# EAGLE design Power2013 (EAGLE 5.06)
DRAWING_NAME: Xiaochuan Chen
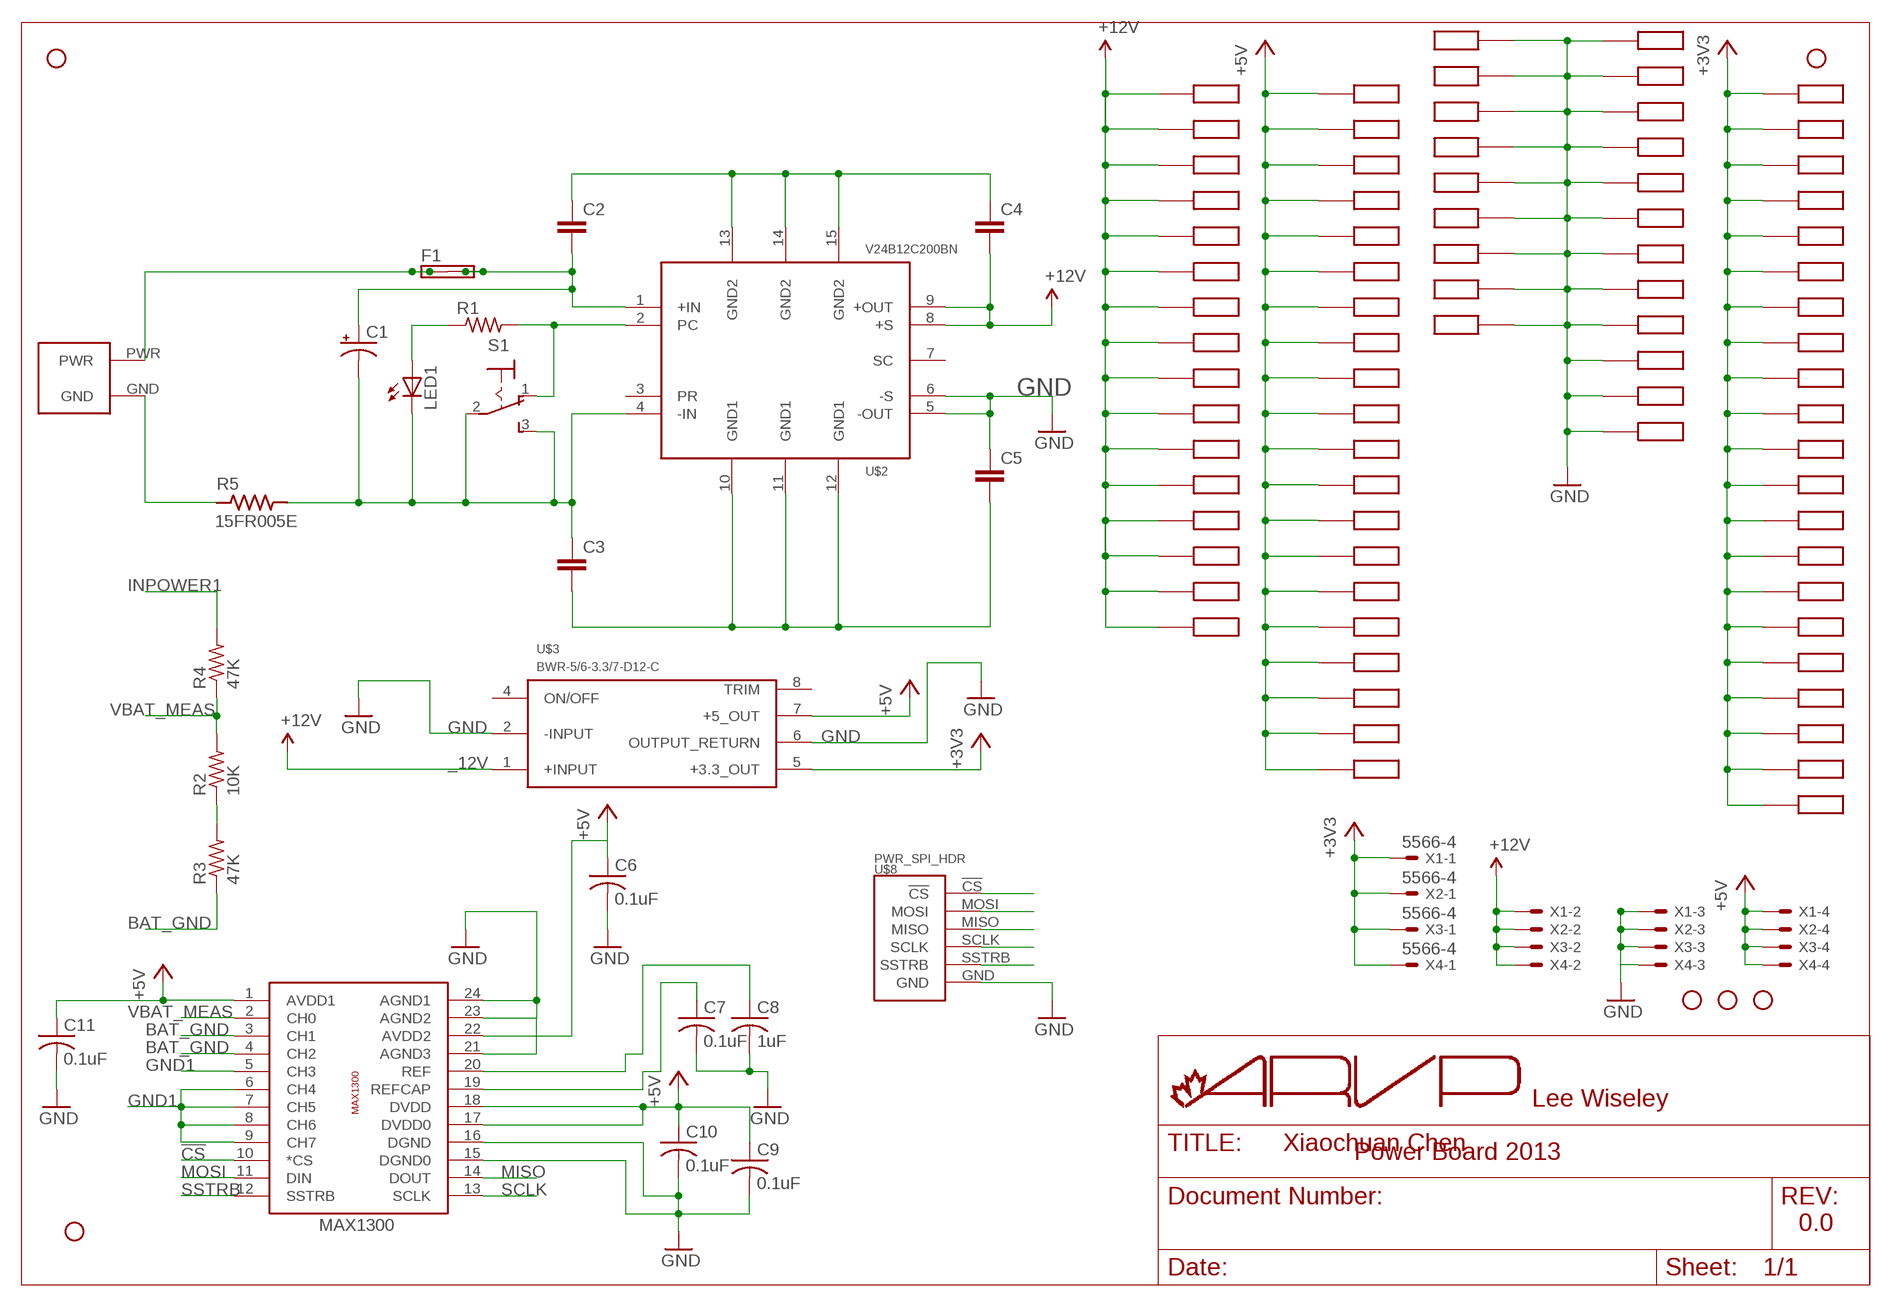
[diagram p0: schematic, sheet 1]

## Parts
C1  CPOL-USE5-10.5  [E5-10,5]
C2  CYYC7B5  [YC7B5]
C3  CYYC7B5  [YC7B5]
C4  CYYC7B5  [YC7B5]
C5  CYYC7B5  [YC7B5]
C6  0.1uF  C-USC0603K  [C0603K]
C7  0.1uF  C-USC0603K  [C0603K]
C8  1uF  C-USC0603K  [C0603K]
C9  0.1uF  C-USC0603K  [C0603K]
C10  0.1uF  C-USC0603K  [C0603K]
C11  0.1uF  C-USC0603K  [C0603K]
F1  SHKOG  [SHKOG]
JP1  STAND-OFF  [STAND-OFF]
JP2  STAND-OFF  [STAND-OFF]
JP4  STAND-OFF  [STAND-OFF]
JP5  STAND-OFF  [STAND-OFF]
JP6  STAND-OFF  [STAND-OFF]
JP7  STAND-OFF  [STAND-OFF]
LED1  LED5MM  [LED5MM]
R1  R-US_0207/10  [0207/10]
R2  10K  R-US_0207/10  [0207/10]
R3  47K  R-US_0207/10  [0207/10]
R4  47K  R-US_0207/10  [0207/10]
R5  15FR005E  15FRXXXE  [15FRXXXE]
S1  M9040P  [M9040P]
U$2  V24B12C200BN  [V24B12C200BN]
U$3  BWR-5/6-3.3/7-D12-C  [BWR-5/6-3.3/7-D12-C]
U$6  MAX1300  [MAX1300]
U$7  AND_PWR  [AND_PWR]
U$8  PWR_SPI_HDR  [PWR_SPI_HDR]
U$9  PWRPAD  [PWRPAD]
U$10  PWRPAD  [PWRPAD]
U$11  PWRPAD  [PWRPAD]
U$12  PWRPAD  [PWRPAD]
U$13  PWRPAD  [PWRPAD]
U$14  PWRPAD  [PWRPAD]
U$15  PWRPAD  [PWRPAD]
U$16  PWRPAD  [PWRPAD]
U$17  PWRPAD  [PWRPAD]
U$18  PWRPAD  [PWRPAD]
U$19  PWRPAD  [PWRPAD]
U$20  PWRPAD  [PWRPAD]
U$21  PWRPAD  [PWRPAD]
U$22  PWRPAD  [PWRPAD]
U$23  PWRPAD  [PWRPAD]
U$24  PWRPAD  [PWRPAD]
U$25  PWRPAD  [PWRPAD]
U$26  PWRPAD  [PWRPAD]
U$27  PWRPAD  [PWRPAD]
U$28  PWRPAD  [PWRPAD]
U$29  PWRPAD  [PWRPAD]
U$30  PWRPAD  [PWRPAD]
U$31  PWRPAD  [PWRPAD]
U$32  PWRPAD  [PWRPAD]
U$33  PWRPAD  [PWRPAD]
U$34  PWRPAD  [PWRPAD]
U$35  PWRPAD  [PWRPAD]
U$36  PWRPAD  [PWRPAD]
U$37  PWRPAD  [PWRPAD]
U$38  PWRPAD  [PWRPAD]
U$39  PWRPAD  [PWRPAD]
U$40  PWRPAD  [PWRPAD]
U$41  PWRPAD  [PWRPAD]
U$42  PWRPAD  [PWRPAD]
U$43  PWRPAD  [PWRPAD]
U$44  PWRPAD  [PWRPAD]
U$45  PWRPAD  [PWRPAD]
U$46  PWRPAD  [PWRPAD]
U$47  PWRPAD  [PWRPAD]
U$48  PWRPAD  [PWRPAD]
U$49  PWRPAD  [PWRPAD]
U$50  PWRPAD  [PWRPAD]
U$51  PWRPAD  [PWRPAD]
U$52  PWRPAD  [PWRPAD]
U$53  PWRPAD  [PWRPAD]
U$54  PWRPAD  [PWRPAD]
U$55  PWRPAD  [PWRPAD]
U$56  PWRPAD  [PWRPAD]
U$58  PWRPAD  [PWRPAD]
U$59  PWRPAD  [PWRPAD]
U$60  PWRPAD  [PWRPAD]
U$61  PWRPAD  [PWRPAD]
U$62  PWRPAD  [PWRPAD]
U$63  PWRPAD  [PWRPAD]
U$64  PWRPAD  [PWRPAD]
U$65  PWRPAD  [PWRPAD]
U$66  PWRPAD  [PWRPAD]
U$67  PWRPAD  [PWRPAD]
U$68  PWRPAD  [PWRPAD]
U$69  PWRPAD  [PWRPAD]
U$70  PWRPAD  [PWRPAD]
U$71  PWRPAD  [PWRPAD]
U$72  PWRPAD  [PWRPAD]
U$73  PWRPAD  [PWRPAD]
U$74  PWRPAD  [PWRPAD]
U$75  PWRPAD  [PWRPAD]
U$76  PWRPAD  [PWRPAD]
U$77  PWRPAD  [PWRPAD]
U$78  PWRPAD  [PWRPAD]
U$80  PWRPAD  [PWRPAD]
U$81  PWRPAD  [PWRPAD]
U$82  PWRPAD  [PWRPAD]
U$83  PWRPAD  [PWRPAD]
U$84  PWRPAD  [PWRPAD]
U$85  PWRPAD  [PWRPAD]
U$86  PWRPAD  [PWRPAD]
U$87  PWRPAD  [PWRPAD]
U$88  PWRPAD  [PWRPAD]
X1  5566-4  [5566-4]
X2  5566-4  [5566-4]
X3  5566-4  [5566-4]
X4  5566-4  [5566-4]

## Nets
12V: C4.2 U$2.8(+S) U$2.9(+OUT) U$3.1(+INPUT) U$9.P$1 U$10.P$1 U$11.P$1 U$12.P$1 U$13.P$1 U$14.P$1 U$15.P$1 U$16.P$1 U$17.P$1 U$18.P$1 U$19.P$1 U$20.P$1 U$58.P$1 U$59.P$1 U$60.P$1 U$61.P$1 X1.2 X2.2 X3.2 X4.2 ; supply symbol labelled +12V
!CS: U$6.10(*CS) U$8.!CS
+3V3: U$3.5(+3.3_OUT) U$45.P$1 U$46.P$1 U$47.P$1 U$48.P$1 U$49.P$1 U$50.P$1 U$51.P$1 U$52.P$1 U$53.P$1 U$54.P$1 U$55.P$1 U$56.P$1 U$70.P$1 U$71.P$1 U$72.P$1 U$73.P$1 U$84.P$1 U$85.P$1 U$86.P$1 U$87.P$1 U$88.P$1 X1.1 X2.1 X3.1 X4.1
+5V: C6.1 C9.1 C10.1 C11.1 U$3.7(+5_OUT) U$6.1(AVDD1) U$6.17(DVDD0) U$6.18(DVDD) U$6.22(AVDD2) U$21.P$1 U$22.P$1 U$23.P$1 U$24.P$1 U$25.P$1 U$26.P$1 U$27.P$1 U$28.P$1 U$29.P$1 U$30.P$1 U$31.P$1 U$32.P$1 U$62.P$1 U$63.P$1 U$64.P$1 U$65.P$1 U$80.P$1 U$81.P$1 U$82.P$1 U$83.P$1 X1.4 X2.4 X3.4 X4.4
BAT_GND: R3.1 R5.P$1 U$6.3(CH1) U$6.5(CH3) U$7.GND
GND: C5.1 C6.2 C7.2 C8.2 C9.2 C10.2 C11.2 U$2.5(-OUT) U$2.6(-S) U$3.2(-INPUT) U$3.6(OUTPUT_RETURN) U$6.15(DGND0) U$6.16(DGND) U$6.21(AGND3) U$6.23(AGND2) U$6.24(AGND1) U$8.GND U$33.P$1 U$34.P$1 U$35.P$1 U$36.P$1 U$37.P$1 U$38.P$1 U$39.P$1 U$40.P$1 U$41.P$1 U$42.P$1 U$43.P$1 U$44.P$1 U$66.P$1 U$67.P$1 U$68.P$1 U$69.P$1 U$74.P$1 U$75.P$1 U$76.P$1 U$77.P$1 U$78.P$1 X1.3 X2.3 X3.3 X4.3
GND1: C1.- C3.1 LED1.K(C) R5.P$2 S1.2(P) S1.3(S) U$2.4(-IN) U$6.4(CH2) U$6.6(CH4) U$6.7(CH5) U$6.8(CH6) U$6.9(CH7)
GND2: C3.2 C5.2 U$2.10(GND1) U$2.11(GND1) U$2.12(GND1)
GND3: C2.1 C4.1 U$2.13(GND2) U$2.14(GND2) U$2.15(GND2)
INPOWER1: F1.1A F1.1B R4.2 U$7.PWR
INPOWER3: C1.+ C2.2 F1.2A F1.2B U$2.1(+IN)
MISO: U$6.14(DOUT) U$8.MISO
MOSI: U$6.11(DIN) U$8.MOSI
N$1: LED1.A R1.1
N$4: R1.2 S1.1(O) U$2.2(PC)
N$5: R2.1 R3.2
N$15: C7.1 U$6.19(REFCAP)
N$16: C8.1 U$6.20(REF)
SCLK: U$6.13(SCLK) U$8.SCLK
SSTRB: U$6.12(SSTRB) U$8.SSTRB
VBAT_MEAS: R2.2 R4.1 U$6.2(CH0)
Unconnected: U$2.3(PR) U$2.7(SC) U$3.4(ON/OFF) U$3.8(TRIM)

## Notes on the sheet
- GND
- INPOWER1
- VBAT_MEAS
- GND
- GND
- _12V
- BAT_GND
- VBAT_MEAS
- BAT_GND
- BAT_GND
- GND1
- GND1 | Lee Wiseley
- !CS | Power Board 2013
- MOSI | MISO
- SSTRB | SCLK
- 0.0

## Library data of the parts
C1 = rcl:CPOL-US: POLARIZED CAPACITOR, American symbol
C2-C5 = rcl:CY: Y CAPACITOR for power line
C6-C11 = rcl:C-US: CAPACITOR, American symbol
F1 = fuse:SHKOG: FUSE HOLDER 5 x 20/6 x 32 mm, SH contact, OG 46G6083 Buerklin
JP1 JP2 JP4-JP7 = SparkFun:STAND-OFF: Stand Off This is the mechanical footprint for a #4 phillips button head screw. Use the keepout ring to avoid running the screw head into surrounding components. SKU : PRT-00447
LED1 = led:LED: LED OSRAM: - CHIPLED LG R971, LG N971, LY N971, LG Q971, LY Q971, LO R971, LY R971 LH N974, LH R974 LS Q976, LO Q976, LY Q976 LO Q996 - Hyper CHIPLED LW Q18S LB Q993, LB Q99A, LB R99A - SideLED LS A670, LO A670, LY A670, LG A670, LP A670 LB A673, LV A673, LT A673, LW A673 LH A674 LY A675 LS A676, LA A676, LO A676, LY A676, LW A676 LS A679, LY A679, LG A679 - Hyper Micro SIDELED® LS Y876, LA Y876, LO Y876, LY Y876 LT Y87S - SmartLED LW L88C, LW L88S LB L89C, LB L89S, LG L890 LS L89K, LO L89K, LY L89K LS L896, LA L896, LO L896, LY L896 - TOPLED LS T670, LO T670, LY T670, LG T670, LP T670 LSG T670, LSP T670, LSY T670, LOP T670, LYG T670 LG T671, LOG T671, LSG T671 LB T673, LV T673, LT T673, LW T673 LH T674 LS T676, LA T676, LO T676, LY T676, LB T676, LH T676, LSB T676, LW T676 LB T67C, LV T67C, LT T67C, LS T67K, LO T67K, LY T67K, LW E67C LS E67B, LA E67B, LO E67B, LY E67B, LB E67C, LV E67C, LT E67C LW T67C LS T679, LY T679, LG T679 LS T770, LO T770, LY T770, LG T770, LP T770 LB T773, LV T773, LT T773, LW T773 LH T774 LS E675, LA E675, LY E675, LS T675 LS T776, LA T776, LO T776, LY T776, LB T776 LHGB T686 LT T68C, LB T68C - Hyper Mini TOPLED® LB M676 - Mini TOPLED Santana® LG M470 LS M47K, LO M47K, LY M47K Source: http://www.osram.convergy.de LUXEON: - LUMILED® LXK2-PW12-R00, LXK2-PW12-S00, LXK2-PW14-U00, LXK2-PW14-V00 LXK2-PM12-R00, LXK2-PM12-S00, LXK2-PM14-U00 LXK2-PE12-Q00, LXK2-PE12-R00, LXK2-PE12-S00, LXK2-PE14-T00, LXK2-PE14-U00 LXK2-PB12-K00, LXK2-PB12-L00, LXK2-PB12-M00, LXK2-PB14-N00, LXK2-PB14-P00, LXK2-PB14-Q00 LXK2-PR12-L00, LXK2-PR12-M00, LXK2-PR14-Q00, LXK2-PR14-R00 LXK2-PD12-Q00, LXK2-PD12-R00, LXK2-PD12-S00 LXK2-PH12-R00, LXK2-PH12-S00 LXK2-PL12-P00, LXK2-PL12-Q00, LXK2-PL12-R00 Source: www.luxeon.com KINGBRIGHT: KA-3528ASYC Source: www.kingbright.com
R1-R4 = rcl:R-US_: RESISTOR, American symbol
R5 = ARVP_07-15-13:15FRXXXE: Ohmite 15FRXXXE Current Sensing Resistors
S1 = switch:M9040P: TOGGLE SWITCH Marquardt
U$2 = ARVP_Linear_Technology:V24B12C200BN
U$3 = ARVP_Linear_Technology:BWR-5/6-3.3/7-D12-C
U$6 = ARVP_07-15-13:MAX1300
U$7 = ARVP_07-15-13:AND_PWR
U$8 = ARVP_07-15-13:PWR_SPI_HDR
U$9-U$56 U$58-U$78 U$80-U$88 = ARVP_07-15-13:PWRPAD
X1-X4 = con-molex:5566-4: Mini FIT connector 4 pol Source: http://www.molex.com

## Board
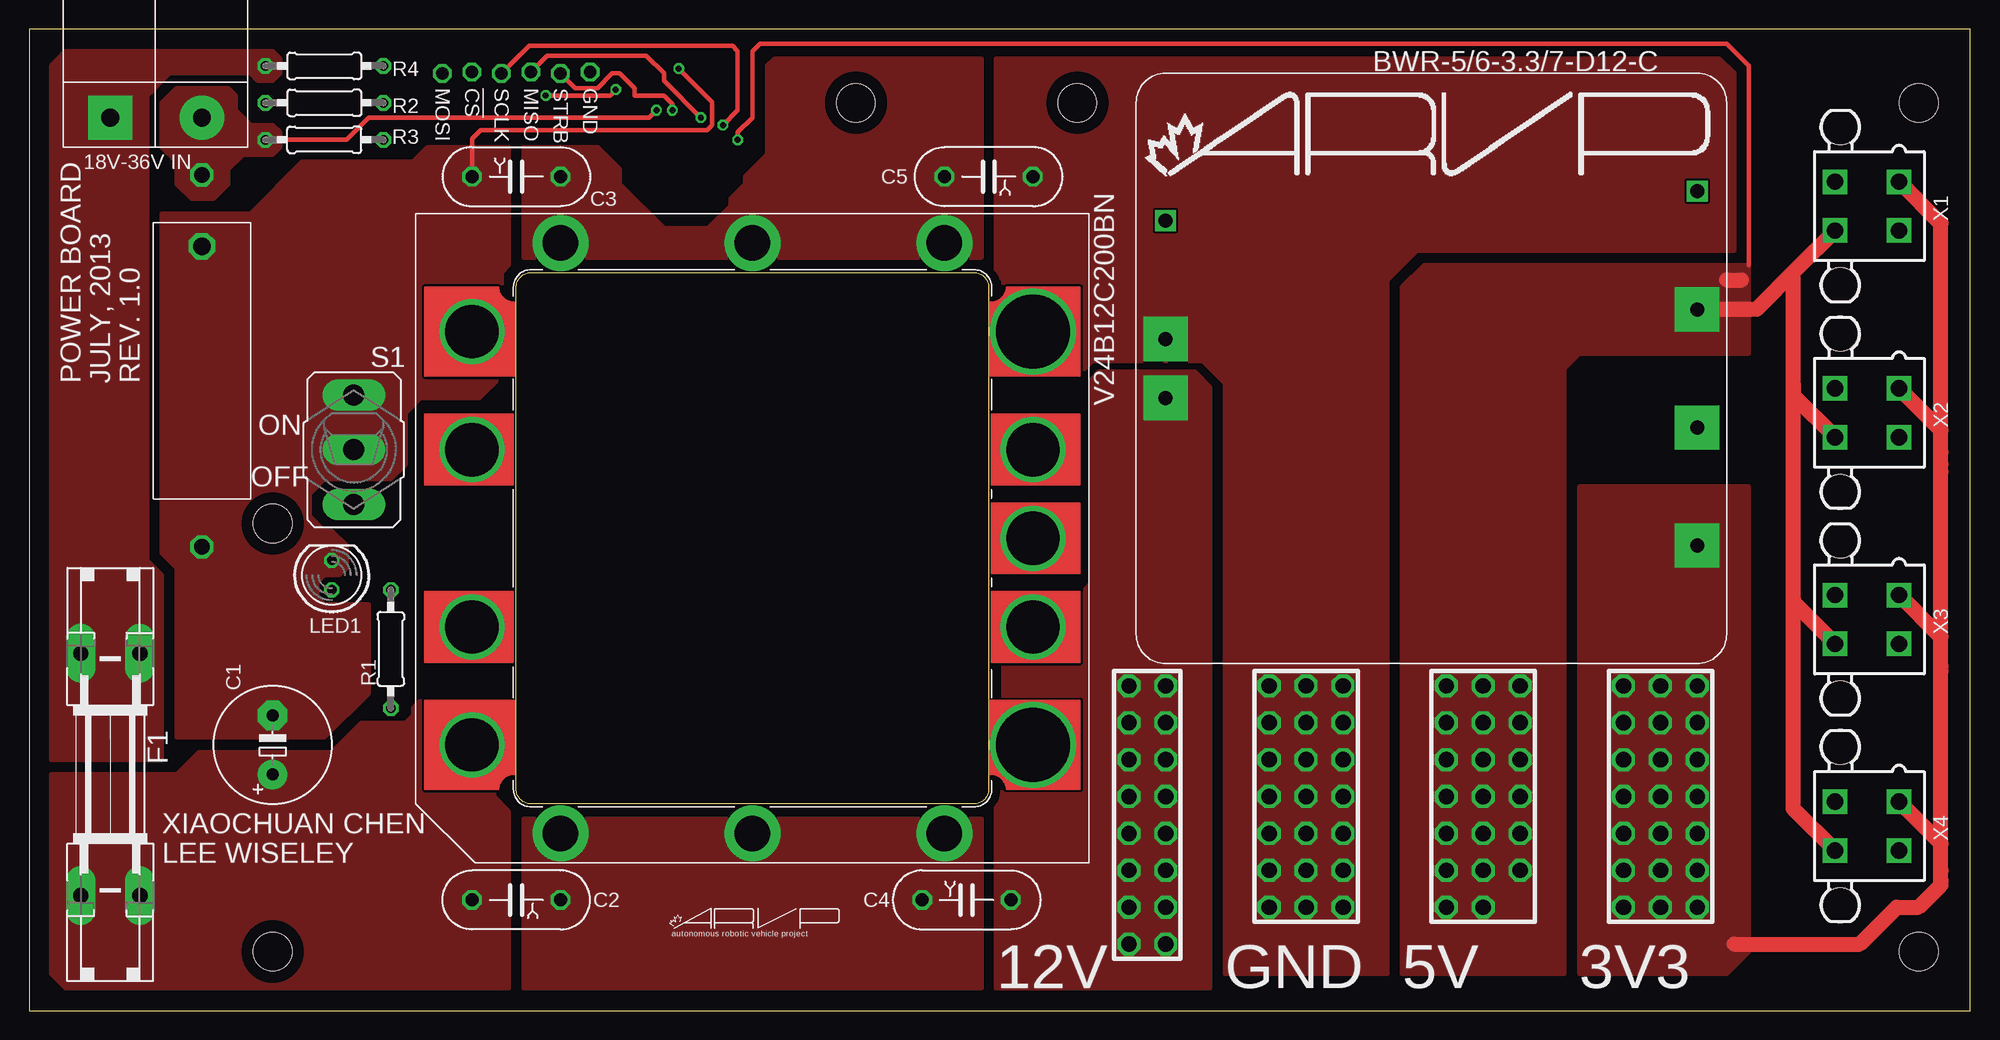
[diagram p1: board, top side]
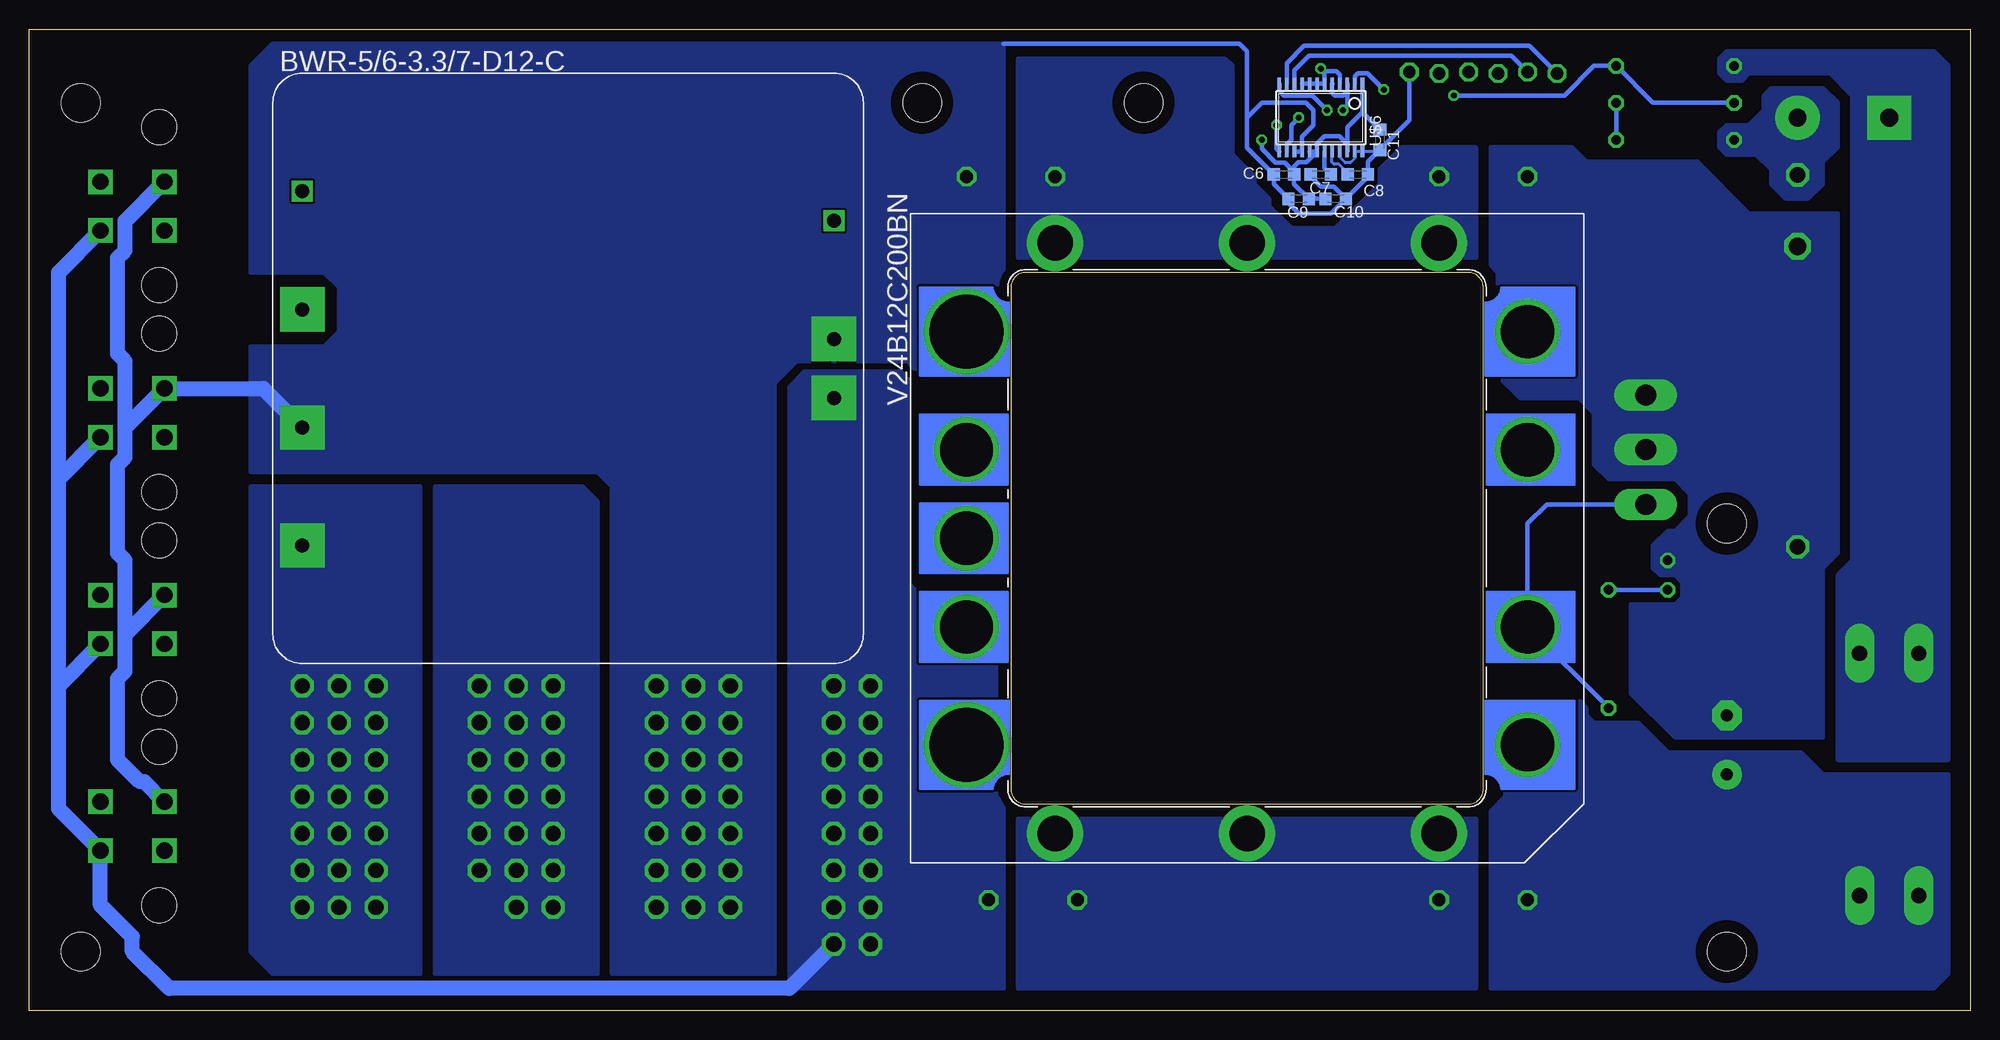
[diagram p2: board, bottom side, seen from below]

Size 167 x 84.45 mm. Coordinates in mm from the lower left corner, seen from the top.
Outline: 0,0 167,0 167,84.45 0,84.45 0,0
Copper layers (1*16): Top 0.035mm / dielectric 1.5mm / Bottom 0.035mm
Design rules "default *": minimum track width 10mil, minimum drill 20mil, track to track 8mil, track to pad 8mil, pad to pad 8mil, via to via 8mil, smd to smd 8mil, copper to edge 40mil, drill to drill 8mil, minimum pad ring 10mil, minimum via ring 8mil, stop-mask expansion 4mil, vias tented up to drill 0mil, thermal gap 0mil

### Footprints (pad centres in the part's own frame; a part is rotated, then mirrored left to right if it is on the bottom)
E5-10,5 = drill 1.016 pad 2.54 round: + -2.54,0 | drill 1.016 pad 2.54 octagon: - 2.54,0
YC7B5 = drill 1.118 octagon: 1 -3.81,0; 2 3.81,0
C0603K = smd 1.05 x 1.08: 1 -0.875,0; 2 0.875,0
SHKOG = drill 1.321 pad 2.54 long: 1A -10.414,2.54; 1B -10.414,-2.54; 2A 10.414,2.54; 2B 10.414,-2.54
STAND-OFF = hole 3.302: 0,0
LED5MM = drill 0.813 octagon: A -1.27,0; K 1.27,0
0207/10 = drill 0.813 octagon: 1 -5.08,0; 2 5.08,0
15FRXXXE = drill 1.321 octagon: P$1 -16,0; P$2 16,0
M9040P = drill 1.803 long: 1 0,4.699; 2 0,0; 3 0,-4.699
V24B12C200BN = drill 4.572 pad 4.826 round: 1 -24.13,17.78; 2 -24.13,7.62; 3 -24.13,-7.62; 4 -24.13,-17.78; 6 24.13,-7.62; 7 24.13,0; 8 24.13,7.62 | drill 6.35 pad 7.112 round: 5 24.13,-17.78; 9 24.13,17.78 | drill 3.048 pad 4.826 round: 10 -16.51,-25.4; 11 0,-25.4; 12 16.51,-25.4; 13 16.51,25.4; 14 0,25.4; 15 -16.51,25.4
BWR-5/6-3.3/7-D12-C = drill 1.2 pad 3.81 square: 1 -22.86,-2.54; 2 -22.86,2.54; 5 22.86,-15.24; 6 22.86,-5.08; 7 22.86,5.08 | drill 1.2 square: 4 -22.86,12.7; 8 22.86,15.24
MAX1300 = smd 0.305 x 0.991: 1 -3.575,-2.918; 2 -2.925,-2.918; 3 -2.275,-2.918; 4 -1.625,-2.918; 5 -0.975,-2.918; 6 -0.325,-2.918; 7 0.325,-2.918; 8 0.975,-2.918; 9 1.625,-2.918; 10 2.275,-2.918; 11 2.925,-2.918; 12 3.575,-2.918; 13 3.575,2.918; 14 2.925,2.918; 15 2.275,2.918; 16 1.625,2.918; 17 0.975,2.918; 18 0.325,2.918; 19 -0.325,2.918; 20 -0.975,2.918; 21 -1.625,2.918; 22 -2.275,2.918; 23 -2.925,2.918; 24 -3.575,2.918
AND_PWR = drill 1.524 pad 3.81 round: GND 0,-7.886 | drill 1.524 pad 3.81 square: PWR 0,0
PWR_SPI_HDR = drill 1.067 octagon: !CS 0.127,3.81; GND 0.127,-6.35; MISO 0.127,-1.27; MOSI 0,6.35; SCLK 0,1.27; SSTRB 0,-3.81
PWRPAD = drill 1.321 octagon: P$1 0,0
5566-4 = drill 1.4 square: 1 2.1,-2.75; 2 -2.1,-2.75; 3 2.1,2.75; 4 -2.1,2.75 | hole 3: 6.8,2.29; -6.8,2.29

### Placement (x,y rotation side)
C1  20.95,22.86 90 top
C2  41.91,9.53 180 top
C3  41.91,71.75 0 top
C4  80.64,9.53 0 top
C5  82.55,71.75 180 top
C6  59.05,71.93 180 bottom
C7  55.88,71.93 180 bottom
C8  52.7,71.93 0 bottom
C9  57.78,69.85 180 bottom
C10  54.61,69.85 0 bottom
C11  50.8,74.93 270 bottom
F1  6.99,20.32 270 top
JP1  20.95,5.08 0 top
JP2  20.95,41.91 0 top
JP4  90.17,78.11 0 top
JP5  162.56,5.08 0 top
JP6  162.56,78.11 0 top
JP7  71.12,78.11 0 top
LED1  26.04,37.47 90 top
R1  31.11,31.11 270 top
R2  25.4,78.11 180 top
R3  25.4,74.93 0 top
R4  25.4,81.28 180 top
R5  14.86,55.91 270 top
S1  27.94,48.26 180 top
U$2  62.23,40.64 180 bottom
U$3  120.64,55.26 0 top
U$5  [ARVP]  55.24,6.35 0 top
U$6  55.88,76.83 180 bottom
U$7  6.99,76.83 90 top
U$8  41.91,80.64 90 top
U$9  97.79,27.94 0 top
U$10  97.79,24.77 0 top
U$11  97.79,21.59 0 top
U$12  97.79,18.41 0 top
U$13  97.79,15.24 0 top
U$14  97.79,12.06 0 top
U$15  94.61,24.77 0 top
U$16  94.61,21.59 0 top
U$17  94.61,18.41 0 top
U$18  94.61,15.24 0 top
U$19  94.61,12.06 0 top
U$20  94.61,27.94 0 top
U$21  128.27,15.24 0 top
U$22  128.27,18.41 0 top
U$23  128.27,21.59 0 top
U$24  128.27,24.77 0 top
U$25  128.27,27.94 0 top
U$26  121.92,27.94 0 top
U$27  125.09,12.06 0 top
U$28  125.09,27.94 0 top
U$29  125.09,24.77 0 top
U$30  125.09,21.59 0 top
U$31  125.09,18.41 0 top
U$32  125.09,15.24 0 top
U$33  113.03,15.24 0 top
U$34  113.03,18.41 0 top
U$35  113.03,21.59 0 top
U$36  113.03,24.77 0 top
U$37  113.03,27.94 0 top
U$38  106.68,27.94 0 top
U$39  109.86,12.06 0 top
U$40  109.86,27.94 0 top
U$41  109.86,24.77 0 top
U$42  109.86,21.59 0 top
U$43  109.86,18.41 0 top
U$44  109.86,15.24 0 top
U$45  137.16,27.94 0 top
U$46  137.16,24.77 0 top
U$47  137.16,21.59 0 top
U$48  137.16,18.41 0 top
U$49  137.16,15.24 0 top
U$50  143.51,27.94 0 top
U$51  140.34,12.06 0 top
U$52  140.34,27.94 0 top
U$53  140.34,24.77 0 top
U$54  140.34,21.59 0 top
U$55  140.34,18.41 0 top
U$56  140.34,15.24 0 top
U$58  94.61,5.71 0 top
U$59  94.61,8.89 0 top
U$60  97.79,8.89 0 top
U$61  97.79,5.71 0 top
U$62  121.92,24.77 0 top
U$63  121.92,21.59 0 top
U$64  121.92,18.41 0 top
U$65  121.92,15.24 0 top
U$66  106.68,24.77 0 top
U$67  106.68,21.59 0 top
U$68  106.68,18.41 0 top
U$69  106.68,15.24 0 top
U$70  143.51,24.77 0 top
U$71  143.51,21.59 0 top
U$72  143.51,18.41 0 top
U$73  143.51,15.24 0 top
U$74  113.03,12.06 0 top
U$75  113.03,8.89 0 top
U$76  109.86,8.89 0 top
U$77  106.68,8.89 0 top
U$78  106.68,12.06 0 top
U$80  125.09,8.89 0 top
U$81  121.92,8.89 0 top
U$82  128.27,12.06 0 top
U$83  121.92,12.06 0 top
U$84  143.51,8.89 0 top
U$85  140.34,8.89 0 top
U$86  137.16,8.89 0 top
U$87  143.51,12.06 0 top
U$88  137.16,12.06 0 top
X1  158.12,69.22 90 top
X2  158.12,51.44 90 top
X3  158.12,33.66 90 top
X4  158.12,15.88 90 top

### Tracks (layer width: path | path; a pad name or v marks a point on that pad's centre or on a via)
12V
  Bottom 1.27: U$61.P$1 101.6,1.91 154.94,1.91 158.12,5.08 158.12,6.35 160.87,9.1 X4.2 164.47,17.38 164.47,24.77 | 164.47,24.77 164.47,25.41 | 164.47,24.77 164.47,26.04 | 164.47,26.04 164.47,43.18 | 164.47,43.18 164.47,43.83 | X3.2 164.47,27.95 164.47,26.04 | X2.2 164.47,45.73 164.47,43.18 | X1.2 164.47,63.52 164.47,43.18
  pour Bottom: 83.19,1.91 83.19,17.78 83.82,18.41 83.82,36.2 90.81,36.2 91.44,36.83 91.44,54.36 92.05,54.97 100.3,54.97 101.6,53.67 101.6,1.91
  pour Top: 83.19,1.91 83.19,18.41 83.82,19.05 83.82,36.2 90.81,36.2 91.44,36.83 91.44,54.36 92.05,54.97 100.3,54.97 101.6,53.67 101.6,1.91
!CS
  Bottom 0.406: U$6.10 58.16,80.91 56.9,82.17 39.5,82.17 U$8.!CS
+3V3
  Top 1.27: 164.47,10.79 164.47,11.2 | 164.47,10.79 164.47,12.06 | 164.47,12.06 164.47,29.21 | 164.47,29.21 164.47,29.61 | 164.47,29.21 164.47,46.35 | 164.47,46.35 164.47,46.99 | 164.47,46.99 164.47,48.03 | X1.1 164.47,67.72 164.47,46.99 | X2.1 164.47,49.94 164.47,46.35 | X3.1 164.47,32.16 164.47,29.21 | X4.1 164.47,14.38 164.47,12.06 | 164.47,10.79 162.56,8.89 160.66,8.89 157.48,5.71 146.69,5.71
  pour Top: 147.96,45.09 133.35,45.09 133.35,3.17 146.05,3.17 147.96,5.08
  pour Bottom: 133.35,45.09 147.96,45.09 147.96,5.08 146.05,3.17 133.35,3.17
+5V  (via drill 0.51)
  Top 0.406: v60.96,74.93 60.96,75.56 62.23,76.83 62.23,82.55 62.87,83.19 146.05,83.19 147.96,81.28 147.96,64.14
  Top 1.27: 146.03,62.87 147.32,62.87 | U$3.7 148.59,60.34 152.07,63.83 | 152.07,63.83 X1.4 | 151.76,35.56 151.76,53.98 | 151.76,53.98 151.76,63.52 152.07,63.83 | X2.4 151.76,52.94 151.76,53.98 | X3.4 151.76,35.16 151.76,35.56 | X4.4 151.76,17.38 151.76,35.56
  Bottom 0.406: 52.3,77.31 C11.1 | 52.3,77.31 U$6.1 | 52.3,77.31 53.6,76.01 U$6.22 53.6,74.56 54.28,75.23 55.58,75.23 56.2,74.61 U$6.18 | U$6.18 U$6.17 56.52,73.58 | C10.1 C9.1 58.18,71.12 | 58.18,71.12 C6.1 58.18,72.63 57.81,73 57.12,73 U$6.18 | 58.18,71.12 58.18,72.15 58.98,72.95 59.77,72.95 60.96,74.14 v60.96,74.93
  pour Top: 147.96,64.14 147.96,56.52 133.35,56.52 132.08,55.24 132.08,3.17 118.11,3.17 118.11,62.23 120.02,64.14
  pour Bottom: 118.11,3.17 132.08,3.17 132.08,45.09 119.38,45.09 118.11,43.81
BAT_GND  (via drill 0.51)
  Top 0.406: R3.1 27.3,74.93 29.21,76.83 53.34,76.83 v53.98,77.47
  Bottom 0.406: v53.98,77.47 53.6,77.84 U$6.3 53.6,79.11 53.98,78.74 54.66,78.74 54.91,78.99 U$6.5
  pour Bottom: 11.43,78.11 12.7,79.38 17.14,79.38 17.78,78.74 17.78,77.47 19.05,76.2 20.95,76.2 21.59,75.56 21.59,74.3 20.95,73.66 18.41,73.66 17.14,72.39 17.14,71.75 17.14,71.12 15.88,69.85 13.97,69.85 12.7,71.12 12.7,71.75 12.7,73.03 11.43,74.3
  pour Top: 11.43,78.11 12.7,79.38 17.14,79.38 17.78,78.74 17.78,77.47 19.05,76.2 20.95,76.2 21.59,75.56 21.59,74.3 20.95,73.66 18.41,73.66 17.14,72.39 17.14,71.12 15.88,69.85 13.97,69.85 12.7,71.12 12.7,73.03 11.43,74.3
GND
  Bottom 0.254: U$6.21 54.26,73.43 53.77,72.95 53.34,72.95 52.96,73.33 U$6.23 U$6.24 50.94,73.92 C11.2
  Bottom 0.406: C10.2 55.01,68.58 57.78,68.58 58.66,69.45 C9.2 59.93,71.12 C6.2 62.23,74.23 | C7.2 56.76,71.77 55.88,70.89 54.78,70.89 C10.2 | 62.23,74.23 62.23,76.83 60.96,78.11 57.15,78.11 56.52,77.47 56.52,76.2 57.51,75.21 U$6.16 U$6.15 | U$8.GND 48.26,76.59 C11.2 51.83,73.03 C8.2 51.83,71.75 C10.2 | U$3.6 143.5,50.16 | 62.23,74.23 62.23,82.55 62.87,83.19 83.19,83.19
  Bottom 1.27: X4.3 157.07,19.68 157.48,19.68 159.38,21.59 159.38,28.57 158.75,29.21 158.75,31.11 | 158.75,31.11 158.75,38.73 159.38,39.37 159.38,46.99 158.75,47.62 158.75,49.53 | 158.75,49.53 158.75,55.88 159.38,56.52 159.38,64.77 158.75,65.41 158.75,67.93 X1.3 | X3.3 158.75,32.37 158.75,31.11 | 158.75,49.53 158.75,50.15 X2.3 146.85,53.53 U$3.6
  pour Bottom: 100.97,55.88 91.44,55.88 90.17,54.61 90.17,45.72 83.82,45.72 83.82,53.98 83.19,54.61 83.19,83.19 146.05,83.19 147.96,81.28 147.96,63.5 141.6,63.5 140.34,62.23 140.34,58.42 141.6,57.15 147.96,57.15 147.96,46.35 118.11,46.35 116.84,45.09 116.84,3.17 102.87,3.17 102.87,53.98
  pour Top: 102.87,3.17 102.87,53.98 100.97,55.88 91.44,55.88 90.17,54.61 90.17,45.72 83.82,45.72 83.82,62.87 83.19,63.5 83.19,81.92 145.41,81.92 146.69,80.64 146.69,65.41 119.38,65.41 116.84,62.87 116.84,3.17
GND1  (via drill 0.51, 1.51)
  Top 0.406: v55.88,81.05 58.75,78.18 58.75,76.17 58.34,75.77 38.86,75.77 38.1,75.01 C3.1
  Bottom 0.406: U$6.4 54.26,80.52 54.56,80.82 55.65,80.82 v55.88,81.05 55.55,80.73 U$6.6 U$6.7 U$6.8 U$6.9
  other vias: 14.86,65.76
  pour Bottom: 25.4,23.5 12.7,23.5 12.7,38.1 11.43,39.37 11.43,68.58 19.05,68.58 23.5,73.03 33.02,73.03 34.29,74.3 41.27,74.3 41.27,64.14 40.64,63.5 40.64,54.61 38.73,52.7 33.66,52.7 32.38,51.44 32.38,46.99 31.11,45.72 25.4,45.72 24.13,44.45 24.13,42.55 25.4,41.27 26.04,41.27 27.3,40.01 27.3,38.1 26.67,37.47 25.4,37.47 24.77,36.83 24.77,35.56 25.4,34.92 29.21,34.92 29.21,27.3
  pour Top: 12.7,23.5 25.4,23.5 29.21,27.3 29.21,34.92 25.4,34.92 24.77,35.56 24.77,36.83 25.4,37.47 26.67,37.47 27.3,38.1 27.3,40.01 26.04,41.27 25.4,41.27 24.13,42.55 24.13,44.45 25.4,45.72 31.11,45.72 32.38,46.99 32.38,51.44 33.66,52.7 38.73,52.7 40.64,54.61 40.64,63.5 41.27,64.14 41.27,74.3 34.29,74.3 33.02,73.03 23.5,73.03 19.05,68.58 11.43,68.58 11.43,39.37 12.7,38.1
GND2
  pour Bottom: 42.55,74.3 42.55,64.77 81.92,64.77 81.92,81.92 64.14,81.92 63.5,81.28 63.5,73.66 61.59,71.75 61.59,71.12 60.33,69.85 60.33,69.22 58.42,67.31 54.61,67.31 50.8,71.12 50.8,72.39 48.9,74.3
  pour Top: 42.55,64.77 42.55,74.3 48.9,74.3 50.8,72.39 50.8,71.12 54.61,67.31 58.42,67.31 60.33,69.22 60.33,69.85 61.59,71.12 61.59,71.75 63.5,73.66 63.5,81.28 64.14,81.92 81.92,81.92 81.92,64.77
GND3
  pour Bottom: 42.55,1.91 42.55,16.51 81.92,16.51 81.92,1.91
  pour Top: 42.55,16.51 81.92,16.51 81.92,1.91 42.55,1.91
INPOWER1
  pour Bottom: 1.91,81.28 1.91,21.59 11.43,21.59 11.43,37.47 10.16,38.73 10.16,78.74 12.06,80.64 19.05,80.64 19.68,80.01 20.95,80.01 21.59,80.64 21.59,81.92 20.95,82.55 3.17,82.55
  pour Top: 3.17,82.55 1.91,81.28 1.91,21.59 11.43,21.59 11.43,37.47 10.16,38.73 10.16,78.74 12.06,80.64 19.05,80.64 19.68,80.01 20.95,80.01 21.59,80.64 21.59,81.92 20.95,82.55
INPOWER3
  pour Bottom: 1.91,20.32 1.91,3.17 3.17,1.91 11.43,1.91 12.06,1.91 41.27,1.91 41.27,16.51 41.27,17.14 40.01,18.41 40.01,25.4 38.1,27.3 34.29,27.3 33.66,26.67 33.02,26.04 33.02,25.4 32.38,24.77 28.57,24.77 26.04,22.23 14.61,22.23 12.7,20.32
  pour Top: 1.91,20.32 1.91,3.17 3.17,1.91 41.27,1.91 41.27,17.14 40.01,18.41 40.01,25.4 38.1,27.3 34.29,27.3 33.02,26.04 33.02,25.4 32.38,24.77 28.57,24.77 26.04,22.23 14.61,22.23 12.7,20.32
MISO  (via drill 0.51)
  Top 0.406: v57.78,76.83 54.61,80.01 54.61,80.64 53.09,82.17 44.58,82.17 U$8.MISO
  Bottom 0.406: v57.78,76.83 58.42,76.2 58.42,74.93 58.8,74.55 U$6.14
MOSI
  Bottom 0.406: U$6.11 58.8,81.53 57.33,83.01 37.92,83.01 U$8.MOSI
N$1
  Bottom 0.406: LED1.A R1.1
N$4
  Bottom 0.406: R1.2 U$2.2 38.1,33.66 | 38.1,33.66 38.1,35.56 | S1.1 36.45,43.56 38.1,41.91 38.1,33.66
N$5
  Bottom 0.406: R3.2 R2.1
N$15
  Bottom 0.406: C7.1 55.55,72.48 U$6.19
N$16
  Bottom 0.254: C8.1 53.58,72.1 54.3,72.82 54.74,72.82 54.91,73 54.91,73.91 U$6.20
SCLK  (via drill 0.51)
  Top 0.406: v59.69,76.2 60.96,77.47 60.96,82.55 60.5,83.01 43,83.01 U$8.SCLK
  Bottom 0.406: v59.69,76.2 59.69,74.15 U$6.13
SSTRB  (via drill 0.51)
  Top 0.406: v55.35,77.47 55.35,78 54.61,78.74 52.07,78.74 52.07,79.38 50.8,80.64 50.16,80.64 48.9,79.38 46.99,79.38 U$8.SSTRB
  Bottom 0.406: U$6.12 59.45,79.14 59.05,78.74 56.62,78.74 v55.35,77.47
VBAT_MEAS  (via drill 0.51)
  Top 0.406: v44.45,78.74 49.96,78.74 v50.47,79.25
  Bottom 0.406: R2.2 27.3,78.11 R4.1 32.38,81.28 34.92,78.74 v44.45,78.74 | v50.47,79.25 51.89,80.67 52.68,80.67 52.95,80.39 U$6.2

### Text on the board
tPlace: MOSI | !CS | SCLK | MISO | STRB | GND | 18V-36V IN | POWER BOARD | JULY, 2013 | REV. 1.0 | ON | OFF | XIAOCHUAN CHEN | LEE WISELEY | 12V | GND | 5V | 3V3
tNames: BWR-5/6-3.3/7-D12-C | V24B12C200BN
bNames: BWR-5/6-3.3/7-D12-C | V24B12C200BN